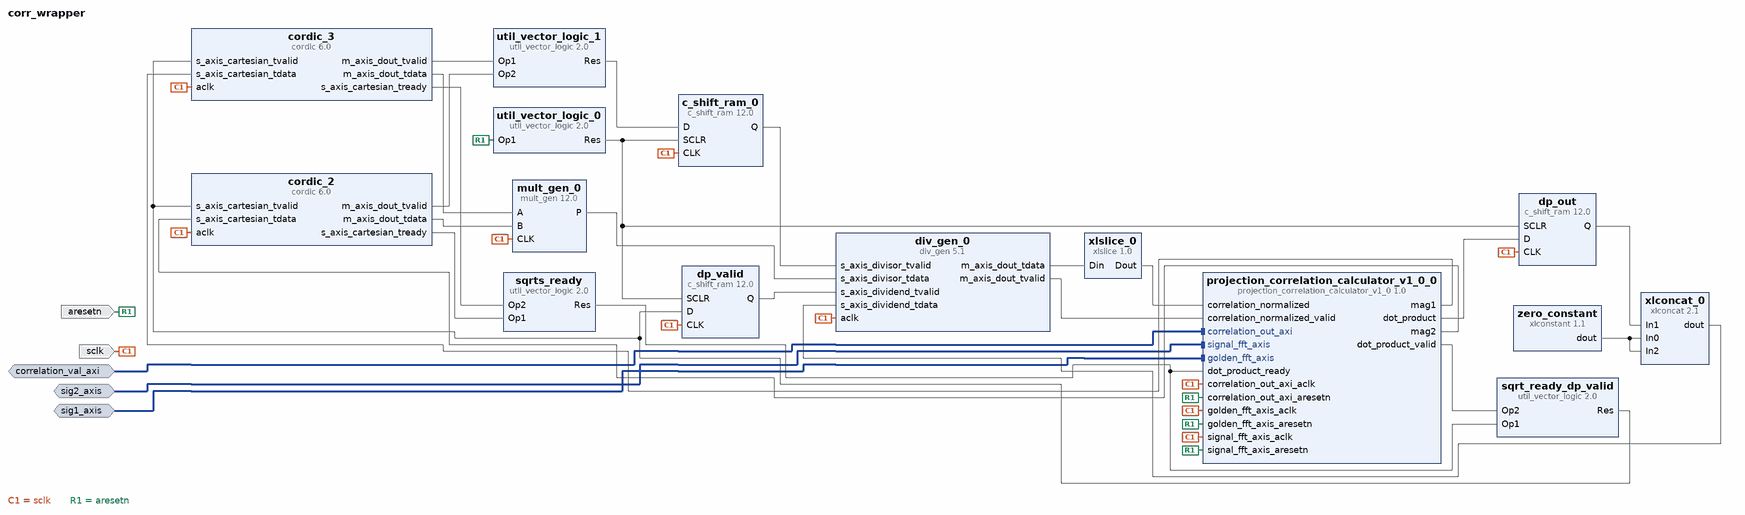
[diagram p0: block diagram of the top level]
# Vivado block design corr_wrapper, xc7a100tcsg324-1, Vivado 2017.2
create_bd_design corr_wrapper

create_bd_intf_port -mode Slave -vlnv xilinx.com:interface:aximm_rtl:1.0 correlation_val_axi
set_property -dict [list \
  CONFIG.DATA_WIDTH 32 \
  CONFIG.PROTOCOL AXI4LITE \
  CONFIG.FREQ_HZ 10000000 \
  CONFIG.ID_WIDTH 0 \
  CONFIG.ADDR_WIDTH 16 \
  CONFIG.AWUSER_WIDTH 0 \
  CONFIG.ARUSER_WIDTH 0 \
  CONFIG.WUSER_WIDTH 0 \
  CONFIG.RUSER_WIDTH 0 \
  CONFIG.BUSER_WIDTH 0 \
  CONFIG.READ_WRITE_MODE READ_WRITE \
  CONFIG.HAS_BURST 0 \
  CONFIG.HAS_LOCK 0 \
  CONFIG.HAS_PROT 1 \
  CONFIG.HAS_CACHE 0 \
  CONFIG.HAS_QOS 0 \
  CONFIG.HAS_REGION 0 \
  CONFIG.HAS_WSTRB 1 \
  CONFIG.HAS_BRESP 1 \
  CONFIG.HAS_RRESP 1 \
  CONFIG.SUPPORTS_NARROW_BURST 0 \
  CONFIG.NUM_READ_OUTSTANDING 1 \
  CONFIG.NUM_WRITE_OUTSTANDING 1 \
  CONFIG.MAX_BURST_LENGTH 1 \
  CONFIG.NUM_READ_THREADS 1 \
  CONFIG.NUM_WRITE_THREADS 1 \
  CONFIG.RUSER_BITS_PER_BYTE 0 \
  CONFIG.WUSER_BITS_PER_BYTE 0 \
] [get_bd_intf_ports correlation_val_axi]
create_bd_intf_port -mode Slave -vlnv xilinx.com:interface:axis_rtl:1.0 sig2_axis
set_property -dict [list \
  CONFIG.TDATA_NUM_BYTES 2 \
  CONFIG.TDEST_WIDTH 0 \
  CONFIG.TID_WIDTH 0 \
  CONFIG.TUSER_WIDTH 0 \
  CONFIG.HAS_TREADY 1 \
  CONFIG.HAS_TSTRB 1 \
  CONFIG.HAS_TKEEP 0 \
  CONFIG.HAS_TLAST 1 \
  CONFIG.FREQ_HZ 10000000 \
  CONFIG.LAYERED_METADATA undef \
] [get_bd_intf_ports sig2_axis]
create_bd_intf_port -mode Slave -vlnv xilinx.com:interface:axis_rtl:1.0 sig1_axis
set_property -dict [list \
  CONFIG.TDATA_NUM_BYTES 2 \
  CONFIG.TDEST_WIDTH 0 \
  CONFIG.TID_WIDTH 0 \
  CONFIG.TUSER_WIDTH 0 \
  CONFIG.HAS_TREADY 1 \
  CONFIG.HAS_TSTRB 1 \
  CONFIG.HAS_TKEEP 0 \
  CONFIG.HAS_TLAST 1 \
  CONFIG.FREQ_HZ 10000000 \
  CONFIG.LAYERED_METADATA undef \
] [get_bd_intf_ports sig1_axis]
create_bd_port -dir I -type clk sclk
set_property -dict {CONFIG.FREQ_HZ 10000000} [get_bd_ports sclk]
create_bd_port -dir I -type rst aresetn

create_bd_cell -type ip -vlnv xilinx.com:ip:div_gen:5.1 div_gen_0
set_property -dict [list \
  CONFIG.dividend_and_quotient_width 64 \
  CONFIG.divisor_width 64 \
  CONFIG.divisor_has_tuser false \
  CONFIG.remainder_type Remainder \
  CONFIG.fractional_width 64 \
  CONFIG.operand_sign Unsigned \
  CONFIG.divide_by_zero_detect true \
  CONFIG.latency 66 \
] [get_bd_cells div_gen_0]
create_bd_cell -type ip -vlnv xilinx.com:ip:mult_gen:12.0 mult_gen_0
set_property -dict [list \
  CONFIG.PortAType Unsigned \
  CONFIG.PortAWidth 32 \
  CONFIG.PortBType Unsigned \
  CONFIG.PortBWidth 32 \
  CONFIG.PipeStages 5 \
] [get_bd_cells mult_gen_0]
create_bd_cell -type ip -vlnv xilinx.com:ip:xlslice:1.0 xlslice_0
set_property -dict {CONFIG.DIN_TO 64 CONFIG.DIN_FROM 95 CONFIG.DIN_WIDTH 128 CONFIG.DOUT_WIDTH 32} [get_bd_cells xlslice_0]
create_bd_cell -type ip -vlnv xilinx.com:ip:c_shift_ram:12.0 c_shift_ram_0
set_property -dict [list \
  CONFIG.CE false \
  CONFIG.Width 1 \
  CONFIG.Depth 5 \
  CONFIG.DefaultData 0 \
  CONFIG.AsyncInitVal 0 \
  CONFIG.SSET false \
  CONFIG.SCLR true \
] [get_bd_cells c_shift_ram_0]
create_bd_cell -type ip -vlnv xilinx.com:ip:util_vector_logic:2.0 util_vector_logic_0
set_property -dict {CONFIG.C_SIZE 1 CONFIG.C_OPERATION not} [get_bd_cells util_vector_logic_0]
create_bd_cell -type ip -vlnv xilinx.com:ip:xlconcat:2.1 xlconcat_0
set_property -dict {CONFIG.NUM_PORTS 3 CONFIG.IN0_WIDTH 8 CONFIG.IN1_WIDTH 48 CONFIG.IN2_WIDTH 8} [get_bd_cells xlconcat_0]
create_bd_cell -type ip -vlnv xilinx.com:ip:xlconstant:1.1 zero_constant
set_property -dict {CONFIG.CONST_WIDTH 8 CONFIG.CONST_VAL 0} [get_bd_cells zero_constant]
create_bd_cell -type ip -vlnv xilinx.com:ip:cordic:6.0 cordic_2
set_property -dict [list \
  CONFIG.Functional_Selection Square_Root \
  CONFIG.Pipelining_Mode Optimal \
  CONFIG.Data_Format UnsignedInteger \
  CONFIG.Input_Width 48 \
  CONFIG.Output_Width 25 \
  CONFIG.Coarse_Rotation false \
  CONFIG.Compensation_Scaling No_Scale_Compensation \
  CONFIG.cartesian_has_tuser false \
  CONFIG.cartesian_has_tlast false \
  CONFIG.flow_control Blocking \
  CONFIG.out_tready false \
  CONFIG.out_tlast_behv Null \
] [get_bd_cells cordic_2]
create_bd_cell -type ip -vlnv xilinx.com:ip:cordic:6.0 cordic_3
set_property -dict [list \
  CONFIG.Functional_Selection Square_Root \
  CONFIG.Pipelining_Mode Optimal \
  CONFIG.Data_Format UnsignedInteger \
  CONFIG.Input_Width 48 \
  CONFIG.Output_Width 25 \
  CONFIG.Coarse_Rotation false \
  CONFIG.Compensation_Scaling No_Scale_Compensation \
  CONFIG.cartesian_has_tuser false \
  CONFIG.cartesian_has_tlast false \
  CONFIG.flow_control Blocking \
  CONFIG.out_tready false \
  CONFIG.out_tlast_behv Null \
] [get_bd_cells cordic_3]
create_bd_cell -type ip -vlnv xilinx.com:ip:util_vector_logic:2.0 util_vector_logic_1
set_property -dict {CONFIG.C_SIZE 1} [get_bd_cells util_vector_logic_1]
create_bd_cell -type ip -vlnv xilinx.com:ip:c_shift_ram:12.0 dp_out
set_property -dict [list \
  CONFIG.CE false \
  CONFIG.Width 48 \
  CONFIG.Depth 19 \
  CONFIG.DefaultData 000000000000000000000000000000000000000000000000 \
  CONFIG.AsyncInitVal 000000000000000000000000000000000000000000000000 \
  CONFIG.SCLR true \
] [get_bd_cells dp_out]
create_bd_cell -type ip -vlnv xilinx.com:ip:util_vector_logic:2.0 sqrts_ready
set_property -dict {CONFIG.C_SIZE 1} [get_bd_cells sqrts_ready]
create_bd_cell -type ip -vlnv xilinx.com:ip:util_vector_logic:2.0 sqrt_ready_dp_valid
set_property -dict {CONFIG.C_SIZE 1} [get_bd_cells sqrt_ready_dp_valid]
create_bd_cell -type ip -vlnv xilinx.com:ip:c_shift_ram:12.0 dp_valid
set_property -dict [list \
  CONFIG.ShiftRegType Fixed_Length \
  CONFIG.Width 1 \
  CONFIG.Depth 19 \
  CONFIG.DefaultData 0 \
  CONFIG.AsyncInitVal 0 \
  CONFIG.SCLR true \
] [get_bd_cells dp_valid]
create_bd_cell -type ip -vlnv user.org:user:projection_correlation_calculator_v1_0:1.0 projection_correlation_calculator_v1_0_0
set_property -dict [list \
  CONFIG.C_fft_AXIS_TDATA_WIDTH 16 \
  CONFIG.C_fft_FIFO_BLOCK_SIZE 10 \
  CONFIG.DOT_PRODUCT_SIZE 48 \
] [get_bd_cells projection_correlation_calculator_v1_0_0]

# ---- connections ----

connect_bd_intf_net [get_bd_intf_ports correlation_val_axi] [get_bd_intf_pins projection_correlation_calculator_v1_0_0/correlation_out_axi]
connect_bd_intf_net [get_bd_intf_ports sig2_axis] [get_bd_intf_pins projection_correlation_calculator_v1_0_0/signal_fft_axis]
connect_bd_intf_net [get_bd_intf_ports sig1_axis] [get_bd_intf_pins projection_correlation_calculator_v1_0_0/golden_fft_axis]
connect_bd_net -net CLK_1 [get_bd_ports sclk] \
  [get_bd_pins mult_gen_0/CLK] [get_bd_pins div_gen_0/aclk] [get_bd_pins c_shift_ram_0/CLK] [get_bd_pins cordic_3/aclk] \
  [get_bd_pins cordic_2/aclk] [get_bd_pins dp_out/CLK] [get_bd_pins dp_valid/CLK] \
  [get_bd_pins projection_correlation_calculator_v1_0_0/signal_fft_axis_aclk] \
  [get_bd_pins projection_correlation_calculator_v1_0_0/golden_fft_axis_aclk] \
  [get_bd_pins projection_correlation_calculator_v1_0_0/correlation_out_axi_aclk]
connect_bd_net [get_bd_pins div_gen_0/m_axis_dout_tdata] [get_bd_pins xlslice_0/Din]
connect_bd_net [get_bd_pins xlslice_0/Dout] [get_bd_pins projection_correlation_calculator_v1_0_0/correlation_normalized]
connect_bd_net [get_bd_pins div_gen_0/m_axis_dout_tvalid] [get_bd_pins projection_correlation_calculator_v1_0_0/correlation_normalized_valid]
connect_bd_net -net correlation_out_axi_aresetn_1 [get_bd_ports aresetn] \
  [get_bd_pins util_vector_logic_0/Op1] [get_bd_pins projection_correlation_calculator_v1_0_0/signal_fft_axis_aresetn] \
  [get_bd_pins projection_correlation_calculator_v1_0_0/golden_fft_axis_aresetn] \
  [get_bd_pins projection_correlation_calculator_v1_0_0/correlation_out_axi_aresetn]
connect_bd_net [get_bd_pins util_vector_logic_0/Res] [get_bd_pins c_shift_ram_0/SCLR] [get_bd_pins dp_valid/SCLR] [get_bd_pins dp_out/SCLR]
connect_bd_net [get_bd_pins c_shift_ram_0/Q] [get_bd_pins div_gen_0/s_axis_divisor_tvalid]
connect_bd_net -net xlconstant_0_dout [get_bd_pins zero_constant/dout] [get_bd_pins xlconcat_0/In0] [get_bd_pins xlconcat_0/In2]
connect_bd_net [get_bd_pins mult_gen_0/P] [get_bd_pins div_gen_0/s_axis_divisor_tdata]
connect_bd_net [get_bd_pins xlconcat_0/dout] [get_bd_pins div_gen_0/s_axis_dividend_tdata]
connect_bd_net [get_bd_pins projection_correlation_calculator_v1_0_0/mag1] [get_bd_pins cordic_3/s_axis_cartesian_tdata]
connect_bd_net [get_bd_pins projection_correlation_calculator_v1_0_0/mag2] [get_bd_pins cordic_2/s_axis_cartesian_tdata]
connect_bd_net [get_bd_pins cordic_3/m_axis_dout_tdata] [get_bd_pins mult_gen_0/A]
connect_bd_net [get_bd_pins cordic_2/m_axis_dout_tdata] [get_bd_pins mult_gen_0/B]
connect_bd_net [get_bd_pins cordic_3/m_axis_dout_tvalid] [get_bd_pins util_vector_logic_1/Op1]
connect_bd_net [get_bd_pins cordic_2/m_axis_dout_tvalid] [get_bd_pins util_vector_logic_1/Op2]
connect_bd_net [get_bd_pins util_vector_logic_1/Res] [get_bd_pins c_shift_ram_0/D]
connect_bd_net [get_bd_pins projection_correlation_calculator_v1_0_0/dot_product] [get_bd_pins dp_out/D]
connect_bd_net [get_bd_pins cordic_3/s_axis_cartesian_tready] [get_bd_pins sqrts_ready/Op2]
connect_bd_net [get_bd_pins cordic_2/s_axis_cartesian_tready] [get_bd_pins sqrts_ready/Op1]
connect_bd_net [get_bd_pins sqrts_ready/Res] \
  [get_bd_pins sqrt_ready_dp_valid/Op1] [get_bd_pins projection_correlation_calculator_v1_0_0/dot_product_ready]
connect_bd_net [get_bd_pins projection_correlation_calculator_v1_0_0/dot_product_valid] [get_bd_pins sqrt_ready_dp_valid/Op2]
connect_bd_net [get_bd_pins sqrt_ready_dp_valid/Res] \
  [get_bd_pins cordic_3/s_axis_cartesian_tvalid] [get_bd_pins cordic_2/s_axis_cartesian_tvalid] [get_bd_pins dp_valid/D]
connect_bd_net [get_bd_pins dp_valid/Q] [get_bd_pins div_gen_0/s_axis_dividend_tvalid]
connect_bd_net [get_bd_pins dp_out/Q] [get_bd_pins xlconcat_0/In1]

# ---- address map ----
assign_bd_address -offset 0x0000 -range 4K -target_address_space [get_bd_addr_spaces correlation_val_axi] [get_bd_addr_segs projection_correlation_calculator_v1_0_0/correlation_out_axi/reg0]

validate_bd_design
save_bd_design
